# EAGLE design wemos_d1_grove_qwiic_v11sch (EAGLE 9.6.2)
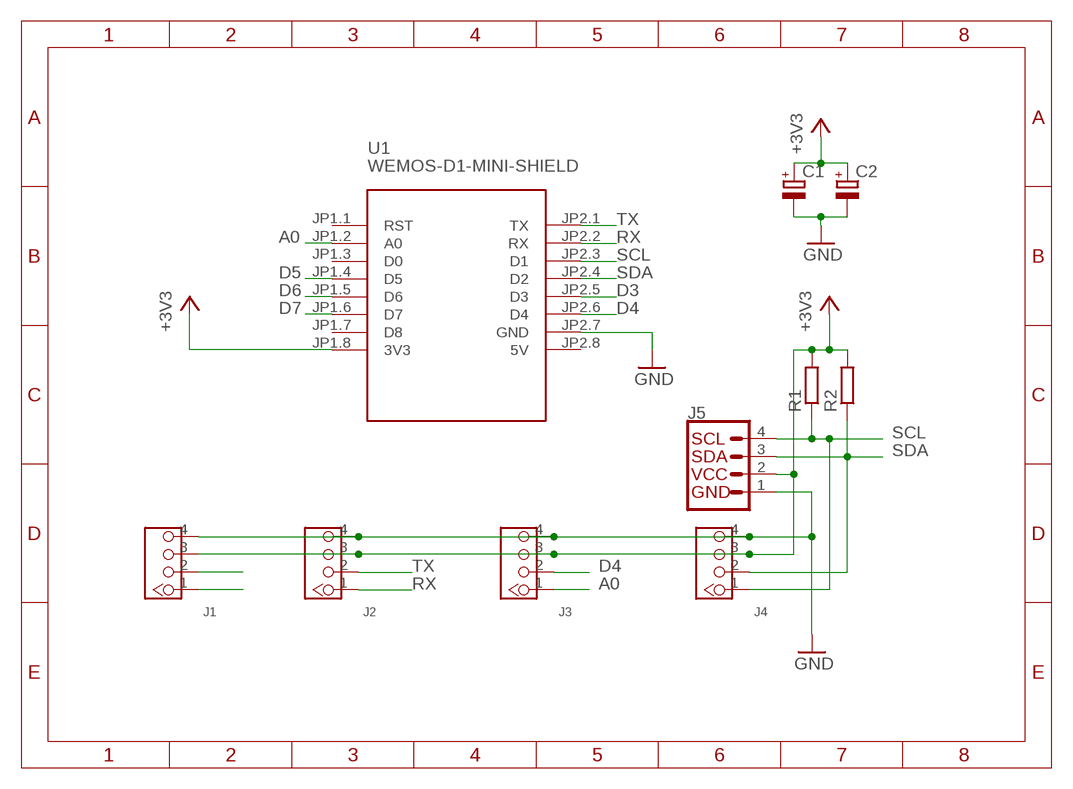
[diagram p0: schematic, sheet 1]

## Parts
C1  CPOL-EU153CLV-0505  [153CLV-0505]
C2  CPOL-EUCT3528  [CT3528]
J1  4P-2.0  GROVE-CONNECTOR-DIP(4P-2.0)  [HW4-2.0]
J2  4P-2.0  GROVE-CONNECTOR-DIP(4P-2.0)  [HW4-2.0]
J3  4P-2.0  GROVE-CONNECTOR-DIP(4P-2.0)  [HW4-2.0]
J4  4P-2.0  GROVE-CONNECTOR-DIP(4P-2.0)  [HW4-2.0]
J5  QWIIC_CONNECTORJS-1MM  [1X04_1MM_RA]
R1  R-EU_R0603  [R0603]
R2  R-EU_R0603  [R0603]
U1  WEMOS-D1-MINI-SHIELD  [WEMOS-D1-MINI-SHIELD]

## Nets
+3V3: C1.+ C2.+ J1.3 J2.3 J3.3 J4.3 J5.2(VCC) R1.2 R2.2 U1.JP1.8(3V3)
A0: J3.1 U1.JP1.2(A0)
D3: U1.JP2.5(D3)
D4: J3.2 U1.JP2.6(D4)
D5: J1.1 U1.JP1.4(D5)
D6: J1.2 U1.JP1.5(D6)
D7: U1.JP1.6(D7)
GND: C1.- C2.- J1.4 J2.4 J3.4 J4.4 J5.1(GND) U1.JP2.7(GND)
RX: J2.1 U1.JP2.2(RX)
SCL: J4.1 J5.4(SCL) R1.1 U1.JP2.3(D1)
SDA: J4.2 J5.3(SDA) R2.1 U1.JP2.4(D2)
TX: J2.2 U1.JP2.1(TX)
Unconnected: U1.JP1.1(RST) U1.JP1.3(D0) U1.JP1.7(D8)

## Power pins joined to a net without a drawn wire
5V: U1.JP2.8(5V)

## Library data of the parts
C1 C2 = rcl:CPOL-EU: POLARIZED CAPACITOR, European symbol; SPICEPREFIX: C
J1-J4 = Seeed-Connector:GROVE-CONNECTOR-DIP(4P-2.0): 320110033
J5 = SparkFun-Connectors:QWIIC_CONNECTOR: SparkFun I2C Standard Qwiic Connector An SMD 1mm pitch JST connector makes it easy and quick (get it? Qwiic?) to connect I2C devices to each other. The Qwiic system <http://www.sparkfun.com/qwiic> enables fast and solderless connection between popular platforms and various sensors and actuators. We carry 200mm <https://www.sparkfun.com/products/14204>, 100mm <https://www.sparkfun.com/products/14205>, 50mm <https://www.sparkfun.com/products/14206>, and breadboard friendly <https://www.sparkfun.com/products/14207> Qwiic cables. We also offer 10 pcs strips <https://www.sparkfun.com/products/14323> the SMD connectors.
R1 R2 = rcl:R-EU_: RESISTOR, European symbol; SPICEPREFIX: R
U1 = diy-modules:WEMOS-D1-MINI-SHIELD: Template for WEMOS D1 mini compatible shields NOTICE: This is a template only. You can use it as a base to create symbols for WEMOS D1 mini compatible shields. Official list of available shields can be found here: https://www.wemos.cc/D1-mini-Shields

## Board
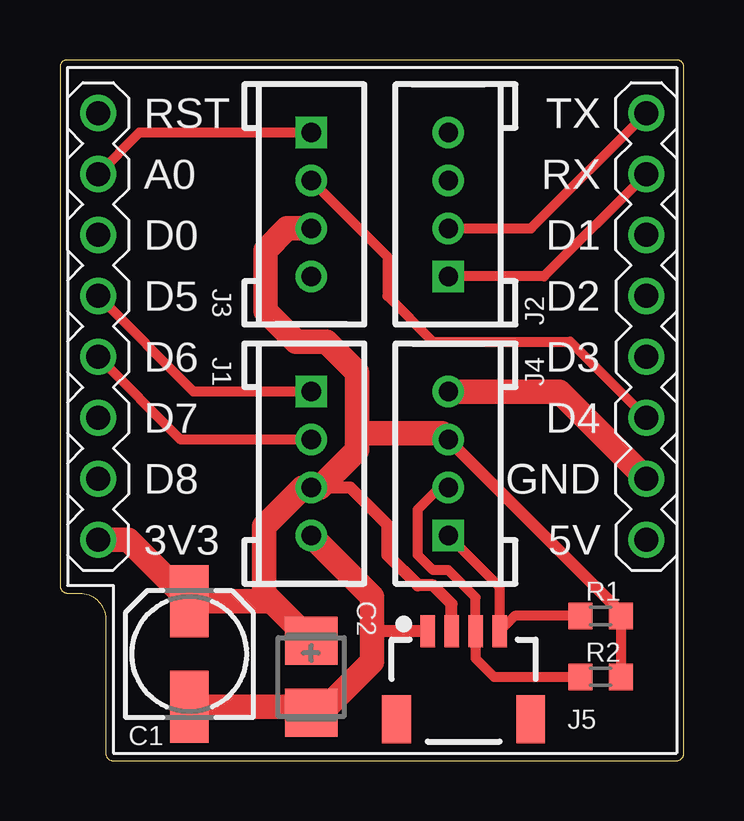
[diagram p1: board, top side]
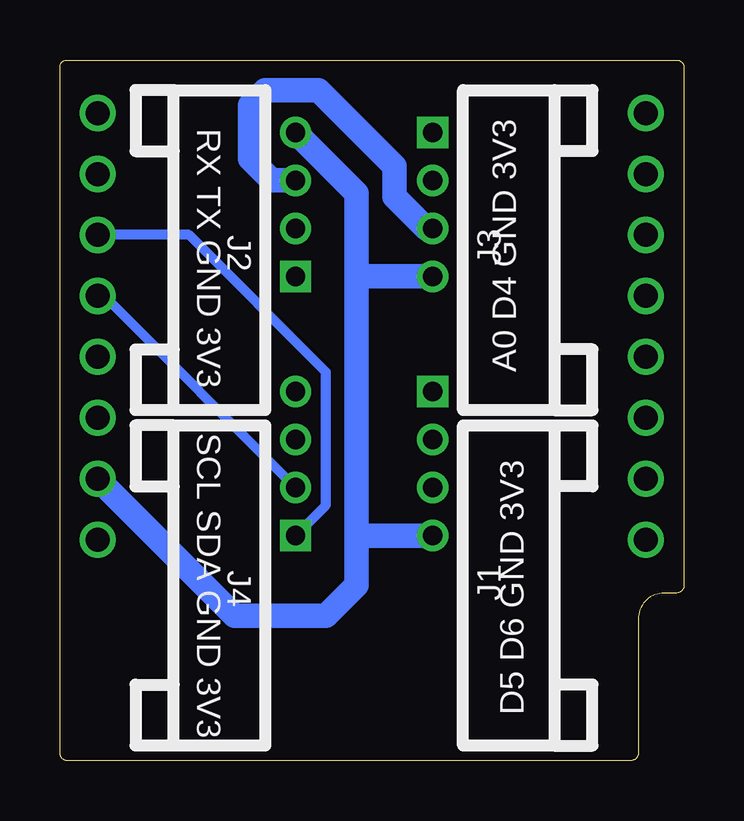
[diagram p2: board, bottom side, seen from below]

Size 26.02 x 29.2 mm. Coordinates in mm from the lower left corner, seen from the top.
Outline: 0,28.89 0,7.3 arc90 0.32,6.99 0.82,6.99 arc-90 1.91,5.9 1.91,0.32 arc90 2.22,0 25.7,0 arc90 26.02,0.32 26.02,28.9 arc90 25.72,29.2 0.3,29.2 arc90 0,28.89
Copper layers (1*16): Top 0.035mm / dielectric 1.5mm / Bottom 0.035mm
Design rules "default *": minimum track width 6mil, minimum drill 0.35mm, track to track 6mil, track to pad 6mil, pad to pad 6mil, via to via 6mil, smd to smd 6mil, copper to edge 20mil, drill to drill 6mil, minimum pad ring 10mil, minimum via ring 8mil, stop-mask expansion 4mil, vias tented up to drill 0mil, thermal gap 10mil

### Footprints (pad centres in the part's own frame; a part is rotated, then mirrored left to right if it is on the bottom)
153CLV-0505 = smd 3 x 1.6: + 2.2,0; - -2.2,0
CT3528 = smd 2 x 2.2: + -1.5,0; - 1.5,0
HW4-2.0 = drill 0.8 pad 1.27 square: 1 -3,0 | drill 0.8 pad 1.27: 2 -1,0; 3 1,0; 4 3,0
1X04_1MM_RA = smd 0.6 x 1.35: 1 -1.5,0; 2 -0.5,0; 3 0.5,0; 4 1.5,0 | smd 1.2 x 2: NC1 2.8,-3.675; NC2 -2.8,-3.675
R0603 = smd 1 x 1.1: 1 -0.85,0; 2 0.85,0
WEMOS-D1-MINI-SHIELD = drill 1: JP1.1 -11.43,12.065; JP1.2 -11.43,9.525; JP1.3 -11.43,6.985; JP1.4 -11.43,4.445; JP1.5 -11.43,1.905; JP1.6 -11.43,-0.635; JP1.7 -11.43,-3.175; JP1.8 -11.43,-5.715; JP2.1 11.43,12.065; JP2.2 11.43,9.525; JP2.3 11.43,6.985; JP2.4 11.43,4.445; JP2.5 11.43,1.905; JP2.6 11.43,-0.635; JP2.7 11.43,-3.175; JP2.8 11.43,-5.715

### Placement (x,y rotation side)
C1  5.4,4.45 90 top
C2  10.48,3.49 270 top
J1  10.48,12.38 270 top
J2  16.19,23.18 90 top
J3  10.48,23.18 270 top
J4  16.19,12.38 90 top
J5  16.83,5.4 0 top
R1  22.54,6.03 0 top
R2  22.54,3.49 0 top
U1  13.02,14.92 0 top

### Tracks (layer width: path | path; a pad name or v marks a point on that pad's centre or on a via)
+3V3
  Top 0.406: R1.2 R2.2
  Top 0.508: J5.2 16.33,6.53 15.56,7.3 14.92,7.3 13.65,8.57 13.65,9.84 12.11,11.38 10.82,11.38 | J4.3 23.39,6.18 R1.2
  Top 1.016: U1.JP1.8 2.83,9.21 C1.+ 8.82,6.65 | 8.82,6.65 8.51,6.96 8.51,9.78 10.11,11.38 J1.3 10.82,11.38 12.38,12.94 12.38,13.65 | 8.82,6.65 C2.+ | J3.3 9.48,22.18 8.57,21.27 8.57,18.73 9.84,17.46 11.11,17.46 12.38,16.19 12.38,13.65 | 12.38,13.65 15.92,13.65 J4.3
  Bottom 1.016: J2.3 17.19,24.18 18.1,25.08 18.1,27.31 17.46,27.94 15.24,27.94 12.06,24.77 12.06,23.5 10.75,22.18 J3.3
A0
  Top 0.406: U1.JP1.2 3.32,26.18 J3.1
D4
  Top 0.406: J3.2 13.65,21 13.65,19.37 15.56,17.46 21.27,17.46 U1.JP2.6
D5
  Top 0.406: U1.JP1.4 5.57,15.38 J1.1
D6
  Top 0.406: J1.2 5.03,13.38 U1.JP1.5
GND
  Top 0.508: J5.1 13.02,5.4
  Top 1.016: C1.- 10.14,2.24 10.39,1.99 C2.- 10.88,1.99 13.02,4.13 13.02,5.4 13.02,6.84 J1.4 | J4.4 20.81,15.38 U1.JP2.7
  Bottom 1.016: J2.4 13.65,23.64 13.65,20 | 13.65,20 13.65,9.21 | 13.65,9.21 13.65,7.3 14.92,6.03 18.73,6.03 U1.JP2.7 | J3.4 13.48,20.18 13.65,20 | 13.65,9.21 13.48,9.38 J1.4
RX
  Top 0.406: U1.JP2.2 20.18,20.18 J2.1
SCL
  Top 0.406: J4.1 18.33,7.25 J5.4 18.96,6.03 R1.1
  Bottom 0.406: J4.1 14.92,10.65 14.92,16.19 20.64,21.91 U1.JP2.3
SDA
  Top 0.406: J4.2 15.83,11.38 14.92,10.48 14.92,8.57 15.56,7.94 16.19,7.94 17.33,6.8 J5.3 17.33,4.26 18.1,3.49 R2.1
  Bottom 0.406: J4.2 24.18,19.37 U1.JP2.4
TX
  Top 0.406: J2.2 19.64,22.18 U1.JP2.1

### Text on the board
_bsilk: RX TX GND 3V3 | J2 | J3 | A0 D4 GND 3V3 | SCL SDA GND 3V3 | J4 | J1 | D5 D6 GND 3V3